# EAGLE design LM2735b (EAGLE 7.6.0)
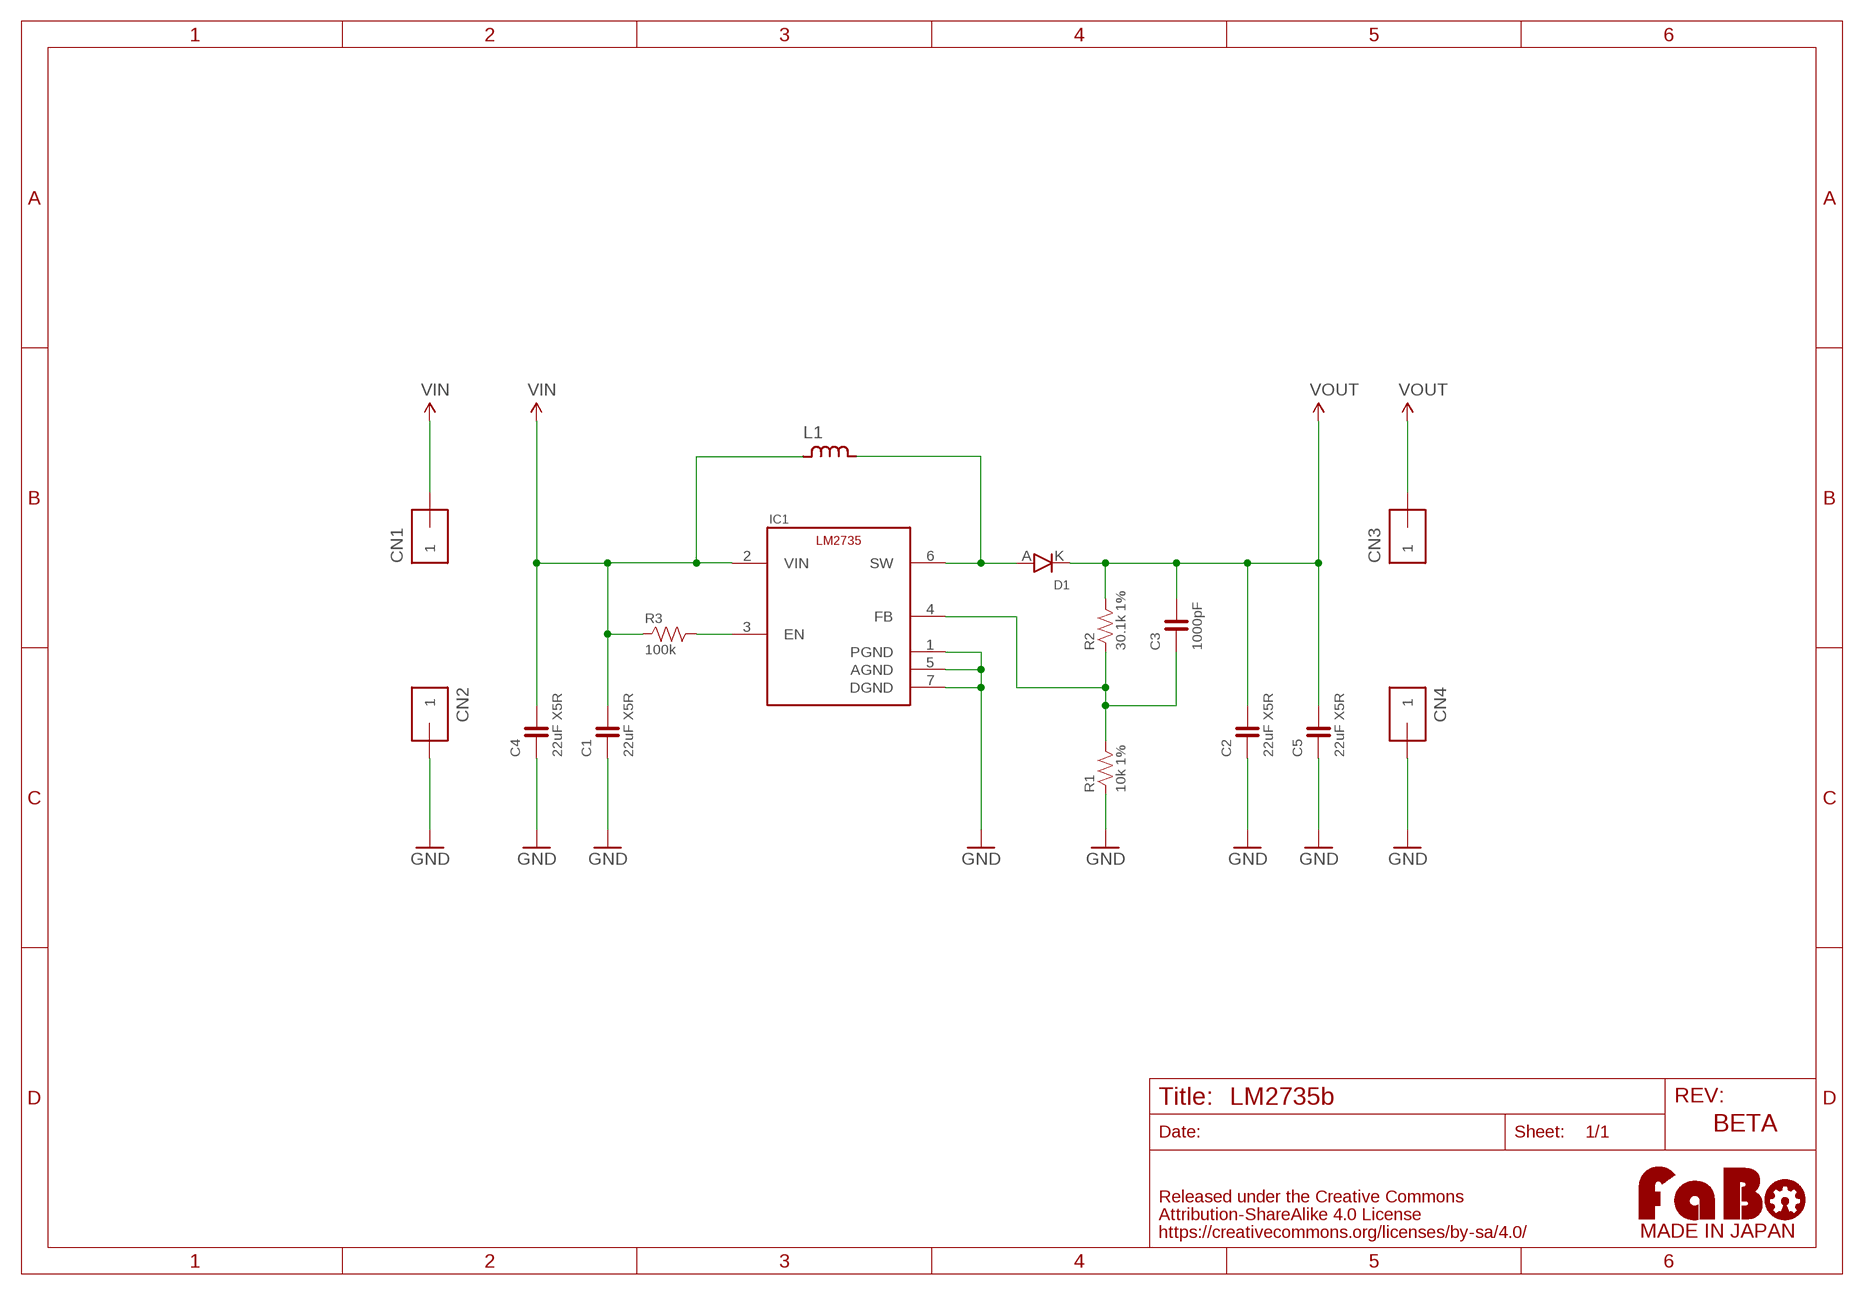
[diagram p0: schematic, sheet 1]

## Parts
C1  22uF X5R  CAPACITOR-0603_NARROW  [0603-NARROW]
C2  22uF X5R  CAPACITOR-0603_NARROW  [0603-NARROW]
C3  1000pF  CAPACITOR-0603_NARROW  [0603-NARROW]
C4  22uF X5R  CAPACITOR-0603_NARROW  [0603-NARROW]
C5  22uF X5R  CAPACITOR-0603_NARROW  [0603-NARROW]
CN1  PIN_HEADER_1X1-SMALL  [PIN_1X1_SMALL]
CN2  PIN_HEADER_1X1-SMALL  [PIN_1X1_SMALL]
CN3  PIN_HEADER_1X1-SMALL  [PIN_1X1_SMALL]
CN4  PIN_HEADER_1X1-SMALL  [PIN_1X1_SMALL]
D1  DIODE-STPS120MF  [ST-MITE-FLAT]
IC1  LM2735YQSDX  [WSON-6]
L1  INDUCTOR-NR6028  [NR6028]
R1  10k 1%  RESISTOR-0603-NARROW  [0603-NARROW]
R2  30.1k 1%  RESISTOR-0603-NARROW  [0603-NARROW]
R3  100k  RESISTOR-0603-NARROW  [0603-NARROW]
U$2  LOGO_FABO-M_BOTTOM  [LOGO_FABO_MS_BOTTOM]

## Nets
FB: C3.1 IC1.4(FB) R1.2 R2.1
GND: C1.1 C2.1 C4.1 C5.1 CN2.1 CN4.1 IC1.1(PGND) IC1.5(AGND) IC1.7(DGND) R1.1
N$5: IC1.3(EN) R3.2
SW: D1.A IC1.6(SW) L1.2
VIN: C1.2 C4.2 CN1.1 IC1.2(VIN) L1.1 R3.1
VOUT: C2.2 C3.2 C5.2 CN3.1 D1.K R2.2

## Notes on the sheet
- BETA

## Library data of the parts
C1-C5 = FaBo-Capacitor:CAPACITOR: CAPACITOR
CN1-CN4 = FaBo-PIN:PIN_HEADER_1X1
D1 = FaBo-Parts:DIODE
IC1 = FaBo-Supply:LM2735
L1 = FaBo-Parts:INDUCTOR
R1-R3 = FaBo-Resistors:RESISTOR: RESISTOR
U$2 = FaBo-Logo:LOGO_FABO

## Board
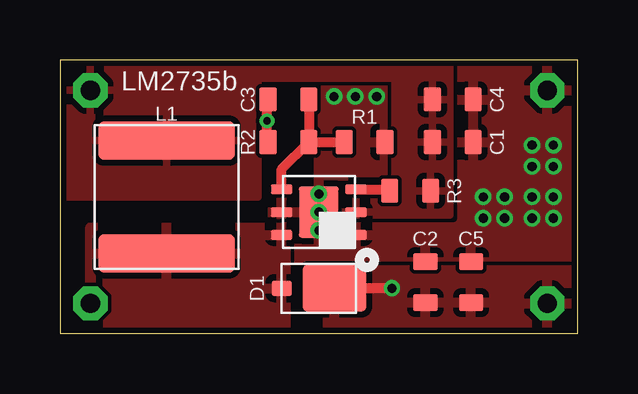
[diagram p1: board, top side]
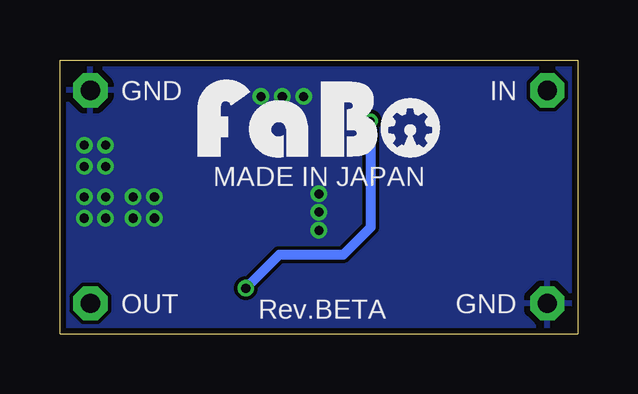
[diagram p2: board, bottom side, seen from below]

Size 21.59 x 11.43 mm. Coordinates in mm from the lower left corner, seen from the top.
Outline: 21.59,0 21.59,11.43 0,11.43 0,0 21.59,0
Copper layers (1*16): Top 0.035mm / dielectric 1.5mm / Bottom 0.035mm
Design rules "Elecrow_angle": minimum track width 6mil, minimum drill 12mil, track to track 6mil, track to pad 6mil, pad to pad 6mil, via to via 6mil, smd to smd 0mil, copper to edge 10mil, drill to drill 10mil, minimum pad ring 10mil, minimum via ring 6mil, stop-mask expansion 2mil, vias tented up to drill 100mil, thermal gap 10mil

### Footprints (pad centres in the part's own frame; a part is rotated, then mirrored left to right if it is on the bottom)
0603-NARROW = smd 0.71 x 1: 1 -0.85,0; 2 0.85,0
PIN_1X1_SMALL = drill 0.8 pad 1.422 octagon: 1 0,0
ST-MITE-FLAT = smd 0.85 x 0.65: A 1.55,0 | smd 2.65 x 1.95: K -0.65,0
WSON-6 = smd 0.4 x 0.9: 1 -0.95,-1.55; 2 0,-1.55; 3 0.95,-1.55; 4 0.95,1.55; 5 0,1.55; 6 -0.95,1.55 | smd 2.15 x 1.65: 7 0,0
NR6028 = smd 1.6 x 5.7: 1 -2.35,0; 2 2.35,0

### Placement (x,y rotation side)
C1  16.38,8 180 top
C2  15.24,2.16 270 top
C3  9.53,9.78 180 top
C4  16.38,9.78 180 top
C5  17.14,2.16 270 top
CN1  1.27,10.16 0 top
CN2  1.27,1.27 0 top
CN3  20.32,1.27 0 top
CN4  20.32,10.16 0 top
D1  10.79,1.91 180 top
IC1  10.79,5.08 90 top
L1  4.45,5.71 270 top
R1  12.7,8 180 top
R2  9.53,8 180 top
R3  14.61,5.97 180 top
U$2  10.79,6.99 0 top

### Tracks (layer width: path | path; a pad name or v marks a point on that pad's centre or on a via)
FB
  Top 0.406: IC1.4 9.24,6.87 R2.1 | R2.1 R1.2 | C3.1 R2.1
GND  (via drill 0.38)
  other vias: 10.79,5.84 10.79,4.32 10.79,5.08 20.57,4.83 19.68,4.83 18.54,4.83 17.65,4.83 17.65,5.71 18.54,5.71 19.68,5.71 20.57,5.71 19.68,6.99 20.57,6.99 20.57,7.87 19.68,7.87 13.21,9.91 12.32,9.91 11.43,9.91
  pour Bottom (rank 5): 0,11.43 21.59,11.43 21.59,0 0,0
  pour Top (rank 5): 21.59,11.43 21.59,2.92 8.89,2.92 8.89,6.22 10.79,6.22 10.79,10.41 13.84,10.41 13.84,6.73 11.81,6.73 11.81,4.57 16.26,4.57 16.26,11.43
N$5
  Top 0.406: IC1.3 13.69,6.03 R3.2
SW
  pour Top (rank 4): 1.27,4.45 9.4,4.45 9.4,0 1.27,0
VIN
  pour Top (rank 3): 11.81,4.95 16.26,4.95 16.26,11.43 0,11.43 0,5.71 8.26,5.71 8.26,10.67 13.97,10.67 13.97,5.71 11.81,5.71
VOUT  (via drill 0.3, 0.38)
  Top 0.406: C3.2 8.64,9.74 v8.64,8.89 8.64,8.04 R2.2 | v13.84,1.91 D1.K
  Bottom 0.406: v8.64,8.89 8.64,4.45 9.78,3.3 12.45,3.3 v13.84,1.91
  pour Top (rank 3): 11.18,2.67 21.59,2.67 21.59,0 11.18,0

### Text on the board
tPlace: LM2735b
bPlace: IN | GND | MADE IN JAPAN | GND | Rev.BETA | OUT